# Altium schematic sheet 14.Power_DCIN.SchDoc
size A4; CheckedBy: YPC; DocumentNumber: 14; Revision: V1.00; SheetNumber: 14; SheetTotal: 18; SheetName: Power; SheetDescribe: SheetDescribe; Designer: JOW; DesignDate: 2025-04-25; CheckedData: 2025-04-25
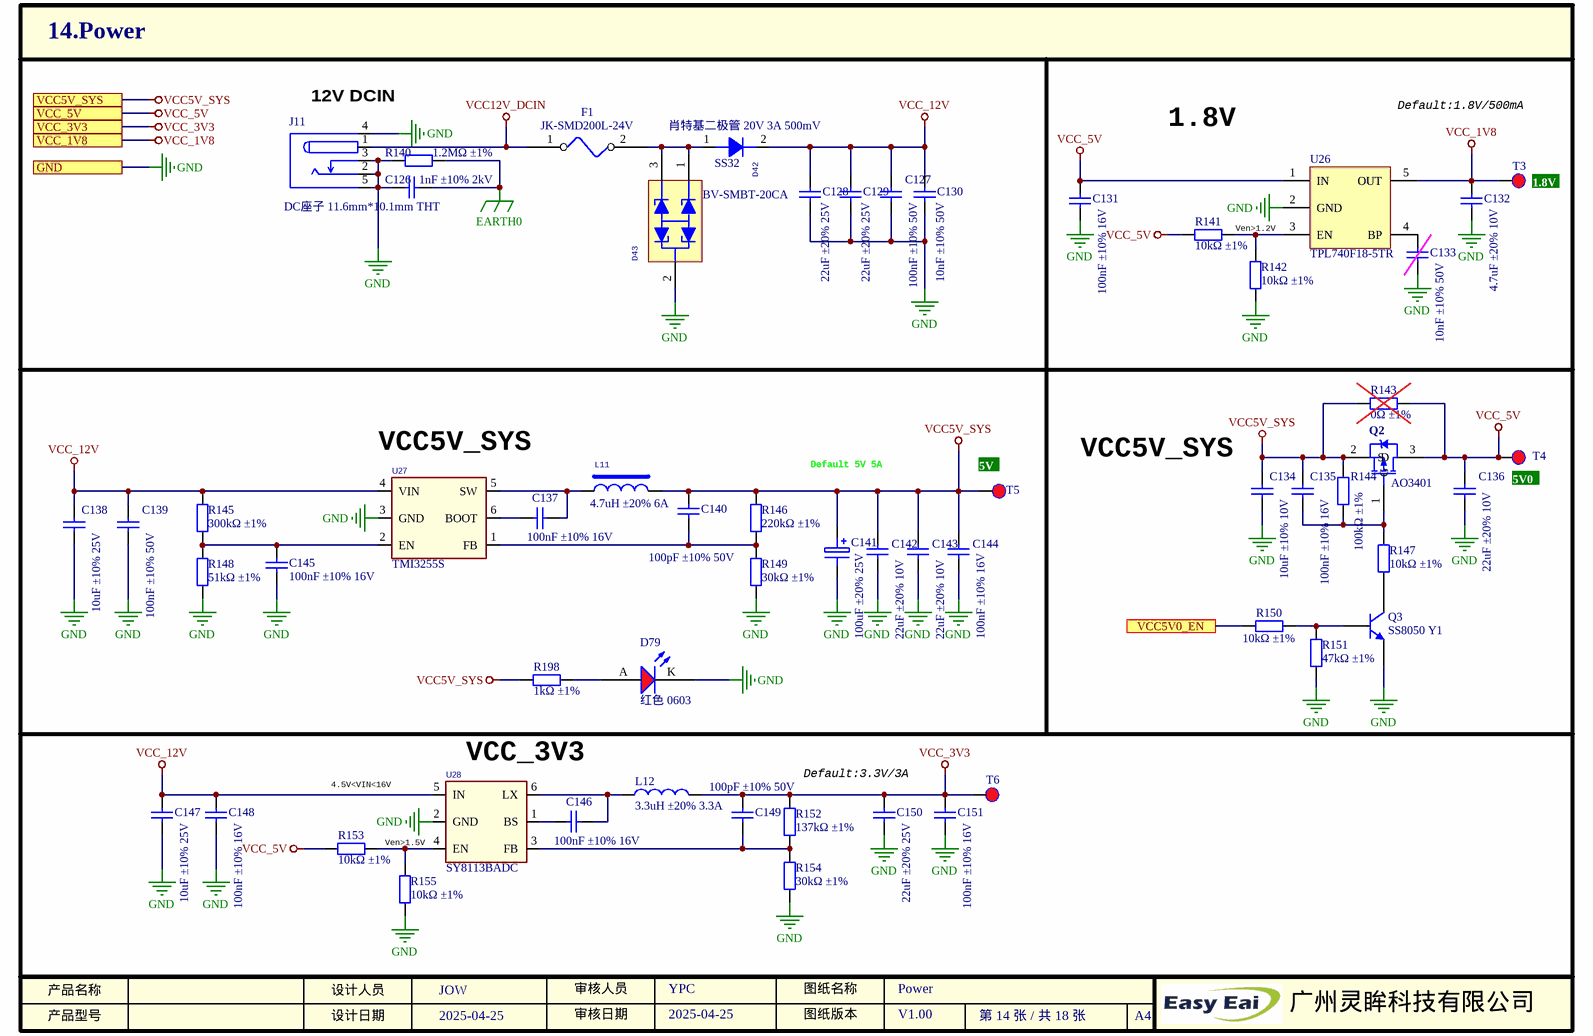
[diagram p0: 14.Power_DCIN.SchDoc]

## Parts
C126  描述: 1nF ±10% 2kV  [1206_C]  (hidden comment: CC1206KKX7RDBB102)
C127  描述: 100nF ±10% 50V  [0603_C]  (hidden comment: CC0603KRX7R9BB104)
C128  描述: 22uF ±20% 25V  [0805_C]  (hidden comment: GRM21BR61E226ME44L)
C129  描述: 22uF ±20% 25V  [0805_C]  (hidden comment: GRM21BR61E226ME44L)
C130  描述: 10nF ±10% 50V  [0402_C]  (hidden comment: CL05B103KB5NNNC)
C131  描述: 100nF ±10% 16V  [0402_C]  (hidden comment: CL05B104KO5NNNC)
C132  描述: 4.7uF ±20% 10V  [0402_C]  (hidden comment: CL05A475MP5NRNC)
C133  描述: 10nF ±10% 50V  [0402_C]  (hidden comment: NC/CL05B103KB5NNNC)  (no BOM)
C134  描述: 10uF ±10% 10V  [0603_C]  (hidden comment: CL10A106KP8NNNC)
C135  描述: 100nF ±10% 16V  [0402_C]  (hidden comment: CL05B104KO5NNNC)
C136  描述: 22uF ±20% 10V  [0603_C]  (hidden comment: CL10A226MP8NUNE)
C137  描述: 100nF ±10% 16V  [0402_C]  (hidden comment: CL05B104KO5NNNC)
C138  描述: 10uF ±10% 25V  [0805_C]  (hidden comment: GRM21BR61E106KA73L)
C139  描述: 100nF ±10% 50V  [0603_C]  (hidden comment: CC0603KRX7R9BB104)
C140  描述: 100pF ±10% 50V  [0402_C]  (hidden comment: CC0402KRX7R9BB101)
C141  描述: 100uF ±20% 25V  [SMD,D6.3xL7.7mm]  (hidden comment: RVT1E101M0607)
C142  描述: 22uF ±20% 10V  [0603_C]  (hidden comment: CL10A226MP8NUNE)
C143  描述: 22uF ±20% 10V  [0603_C]  (hidden comment: CL10A226MP8NUNE)
C144  描述: 100nF ±10% 16V  [0402_C]  (hidden comment: CL05B104KO5NNNC)
C145  描述: 100nF ±10% 16V  [0402_C]  (hidden comment: CL05B104KO5NNNC)
C146  描述: 100nF ±10% 16V  [0402_C]  (hidden comment: CL05B104KO5NNNC)
C147  描述: 10uF ±10% 25V  [0805_C]  (hidden comment: GRM21BR61E106KA73L)
C148  描述: 100nF ±10% 16V  [0402_C]  (hidden comment: CL05B104KO5NNNC)
C149  描述: 100pF ±10% 50V  [0402_C]  (hidden comment: CC0402KRX7R9BB101)
C150  描述: 22uF ±20% 25V  [0805_C]  (hidden comment: GRM21BR61E226ME44L)
C151  描述: 100nF ±10% 16V  [0402_C]  (hidden comment: CL05B104KO5NNNC)
D42  描述: 肖特基二极管 20V 3A 500mV  [DO_214AC]  (hidden comment: 肖特基二极管)
D43  BV-SMBT-20CA  [SMB-T_L5.4-W3.3-BI]
D79  红色 0603  [0603_LED_S1]
F1  JK-SMD200L-24V  [2920]
J11  DC-044A-20A  [DC-044A-20A]  (value not drawn)
L11  MWSA0603S-4R7MT  [IND-SMD_L7.0-W6.6]  (value not drawn)
L12  SMNR4030-3R3MT  [IND-4.0*4.0*3.0]  (value not drawn)
Q2  AO3401  [SOT-23]
Q3  SS8050 Y1  [SOT-23(SOT-23-3)]
R140  描述: 1.2MΩ ±1%  [1206_R]  (hidden comment: 1206W4F1204T5E)
R141  描述: 10kΩ ±1%  [0402_R]  (hidden comment: 0402WGF1002TCE)
R142  描述: 10kΩ ±1%  [0402_R]  (hidden comment: 0402WGF1002TCE)
R143  描述: 0Ω ±1%  [0805_R]  (hidden comment: NC/0805W8F0000T5E)  (no BOM)
R144  描述: 100kΩ ±1%  [0402_R]  (hidden comment: 0402WGF1003TCE)
R145  描述: 300kΩ ±1%  [0402_R]  (hidden comment: 0402WGF3003TCE)
R146  描述: 220kΩ ±1%  [0402_R]  (hidden comment: 0402WGF2203TCE)
R147  描述: 10kΩ ±1%  [0402_R]  (hidden comment: 0402WGF1002TCE)
R148  描述: 51kΩ ±1%  [0402_R]  (hidden comment: 0402WGF5102TCE)
R149  描述: 30kΩ ±1%  [0402_R]  (hidden comment: NQ02WGF3002TCE)
R150  描述: 10kΩ ±1%  [0402_R]  (hidden comment: 0402WGF1002TCE)
R151  描述: 47kΩ ±1%  [0402_R]  (hidden comment: 0402WGF4702TCE)
R152  描述: 137kΩ ±1%  [0402_R]  (hidden comment: 0402WGF1373TCE)
R153  描述: 10kΩ ±1%  [0402_R]  (hidden comment: 0402WGF1002TCE)
R154  描述: 30kΩ ±1%  [0402_R]  (hidden comment: NQ02WGF3002TCE)
R155  描述: 10kΩ ±1%  [0402_R]  (hidden comment: 0402WGF1002TCE)
R198  描述: 1kΩ ±1%  [0402_R]  (hidden comment: 0402WGF1001TCE)
T3  TEST-DOT  [PAD-25/40]  (value not drawn)  (no BOM)
T4  TEST-DOT  [PAD-25/40]  (value not drawn)
T5  TEST-DOT  [PAD-25/40]  (value not drawn)  (no BOM)
T6  TEST-DOT  [PAD-25/40]  (value not drawn)  (no BOM)
U26  TPL740F18-5TR  [SOT-23-5]
U27  TMI3255S  [SOT23-6]
U28  SY8113BADC  [sot23-6]

## Ports
GND, VCC5V0_EN, VCC5V_SYS, VCC_1V8, VCC_3V3, VCC_5V

## Nets
EARTH0: C126.2 R140.2
GND: C126.1 C127.1 C128.1 C129.1 C130.1 C131.1 C132.1 C133.1 C134.1 C136.1 C138.1 C139.1 C141.2 C142.1 C143.1 C144.1 C145.1 C147.1 C148.1 C150.1 C151.1 D43.2 D79.K J11.2 J11.3 J11.4 J11.5 Q3.2(E) R140.1 R142.1 R148.1 R149.1 R151.1 R154.1 R155.1 U26.2(GND) U27.3(GND) U28.2(GND) ; port GND
VCC5V_SYS: C134.2 C135.2 C140.2 C141.1 C142.2 C143.2 C144.2 L11.2 Q2.2(S) R143.1 R144.2 R146.2 R198.1 T5.1 ; port VCC5V_SYS
VCC12V_DCIN: F1.1 J11.1
VCC_1V8: C132.2 T3.1 U26.5(OUT) ; port VCC_1V8
VCC_3V3: C149.2 C150.2 C151.2 L12.2 R152.2 T6.1 ; port VCC_3V3
VCC_5V: C131.2 C136.2 Q2.3(D) R141.1 R143.2 R153.1 T4.1 U26.1(IN) ; port VCC_5V
VCC_12V: C127.2 C128.2 C129.2 C130.2 C138.2 C139.2 C147.2 C148.2 D42.2(K) R145.2 U27.4(VIN) U28.5(IN)
VCC5V0_EN: R150.1 ; port VCC5V0_EN
NetC133_2: C133.2 U26.4(BP)
NetC135_1: C135.1 Q2.1(G) R144.1 R147.2
NetC137_1: C137.1 U27.6(BOOT)
NetC137_2: C137.2 L11.1 U27.5(SW)
NetC140_1: C140.1 R146.1 R149.2 U27.1(FB)
NetC145_2: C145.2 R145.1 R148.2 U27.2(EN)
NetC146_1: C146.1 U28.1(BS)
NetC146_2: C146.2 L12.1 U28.6(LX)
NetC149_1: C149.1 R152.1 R154.2 U28.3(FB)
NetD42_1: D42.1(A) D43.1 D43.3 F1.2
NetD79_A: D79.A R198.2
NetQ3_1: Q3.1(B) R150.2 R151.2
NetQ3_3: Q3.3(C) R147.1
NetR141_2: R141.2 R142.2 U26.3(EN)
NetR153_2: R153.2 R155.2 U28.4(EN)

## Notes on the sheet
- (near J11) 12V DCIN
- Default:1.8V/500mA
- 1.8V
- (near R141) Ven>1.2V
- (near T3) 1.8V
- (near U27) VCC5V_SYS
- Default 5V 5A
- (near T5) 5V
- VCC5V_SYS
- (near T4) 5V0
- 4.5V<VIN<16V
- (near U28) VCC_3V3
- Default:3.3V/3A
- Ven>1.5V
- 产品名称
- 产品型号
- 设计人员
- 设计日期
- 审核人员
- 审核日期
- 图纸版本
- 图纸名称
- A4
- 广州灵眸科技有限公司

## Library data of the parts
C126 = 1206 1nF ±10% 2kV: SPZL000332; 名称: 贴片电容; 厂商: YAGEO(国巨); 封装: 1206; 工作温度: -55~125℃; 贴片和直插: SMD; 型号: CC1206KKX7RDBB102; SuppliersPartNumber: C23631; 商品编号: SPZL000332
C127 C139 = 0603 100nF ±10% 50V: SPZL000386; 名称: 贴片电容; 厂商: YAGEO(国巨); 封装: 0603; 工作温度: -55~125℃; 贴片和直插: SMD; 型号: CC0603KRX7R9BB104; SuppliersPartNumber: C14663; 商品编号: SPZL000386
C128 C129 C150 = 0805 22uF ±20% 25V: SPZL000267; 名称: 贴片电容; 厂商: muRata(村田); 封装: 0805; 工作温度: -55~85℃; 贴片和直插: SMD; 型号: GRM21BR61E226ME44L; SuppliersPartNumber: C86816; 商品编号: SPZL000267
C130 C133 = 0402 10nF ±10% 50V: SPZL000342; 名称: 贴片电容; 厂商: SAMSUNG(三星); 封装: 0402; 工作温度: -55~125℃; 贴片和直插: SMD; 型号: CL05B103KB5NNNC; SuppliersPartNumber: C15195; 商品编号: SPZL000342
C131 C135 C137 C144-C146 C148 C151 = 0402 100nF ±10% 16V: SPZL000259; 名称: 贴片电容; 厂商: SAMSUNG(三星); 封装: 0402; 工作温度: -55~125℃; 贴片和直插: SMD; 型号: CL05B104KO5NNNC; SuppliersPartNumber: C1525; 商品编号: SPZL000259
C132 = 0402 4.7uF ±20% 10V: SPZL000339; 名称: 贴片电容; 厂商: SAMSUNG(三星); 封装: 0402; 工作温度: -55~85℃; 贴片和直插: SMD; 型号: CL05A475MP5NRNC; SuppliersPartNumber: C23733; 商品编号: SPZL000339
C134 = 0603 10uF ±10% 10V: SPZL000260; 名称: 贴片电容; 厂商: SAMSUNG(三星); 封装: 0603; 工作温度: -55~85℃; 贴片和直插: SMD; 型号: CL10A106KP8NNNC; SuppliersPartNumber: C19702; 商品编号: SPZL000260
C136 C142 C143 = 0603 22uF ±20% 10V: SPZL000315; 名称: 贴片电容; 厂商: SAMSUNG(三星); 封装: 0603; 工作温度: -55~85℃; 贴片和直插: SMD; 型号: CL10A226MP8NUNE; SuppliersPartNumber: C86295; 商品编号: SPZL000315
C138 C147 = 0805 10uF ±10% 25V: SPZL000262; 名称: 贴片电容; 厂商: muRata(村田); 封装: 0805; 工作温度: -55~85℃; 贴片和直插: SMD; 型号: GRM21BR61E106KA73L; SuppliersPartNumber: C84416; 商品编号: SPZL000262
C140 C149 = 0402 100pF ±10% 50V: SPZL000312; 名称: 贴片电容; 厂商: YAGEO(国巨); 封装: 0402; 工作温度: -55~125℃; 贴片和直插: SMD; 型号: CC0402KRX7R9BB101; SuppliersPartNumber: C281751; 商品编号: SPZL000312
C141 = 电解电容 100uF ±20% 25V: SPZL000519; 名称: 电解电容; 厂商: ROQANG(容强); 贴片和直插: SMD; 工作温度: -45~105℃; SuppliersPartNumber: C72477; 封装: SMD,D6.3xL7.7mm; 型号: RVT1E101M0607; 商品编号: SPZL000519
D42 = SS32: SPZL000094; 名称: 二极管; 厂商: MDD; 贴片和直插: SMD; 封装: SMA(DO-214AC); 工作温度: -55~125℃; SuppliersPartNumber: C34897; 商品编号: SPZL000094; 型号: SS32
D43 = TVS BV-SMBT-20CA: SPZL000611; 名称: TVS; 封装: SMB-T; 贴片和直插: SMD; 厂商: Bencent(槟城); 描述: Cj=2500pF; 工作温度: -40~125℃; 商品编号: SPZL000611; 型号: BV-SMBT-20CA
D79 = 红色 0603: SPZL000214; 厂商: EVERLIGHT(台湾亿光); 封装: 0603; 贴片和直插: SMD; 型号: 19-217/R6C-AL1M2VY/3T; 名称: LED; 工作温度: -40~85℃; SuppliersPartNumber: C72044; 商品编号: SPZL000214; 描述: 红色 0603
F1 = 自恢复保险丝 JK-SMD200L-24V: SPZL000105; 厂商: JK(金科); 名称: 自恢复保险丝; 贴片和直插: SMD; 描述: 2A/24V; 工作温度: -40~85℃; 封装: 2920; SuppliersPartNumber: C692154; 商品编号: SPZL000105; 型号: JK-SMD200L-24V
J11 = DC座子 11.6mm*10.1mm THT: SPZL000133; 封装: THT; 厂商: 韩国韩荣; 名称: 电源插座; 工作温度: -20~70℃; 贴片和直插: THT; SuppliersPartNumber: C129006; 型号: DC-044A-20A; 商品编号: SPZL000133; 描述: DC座子 11.6mm*10.1mm THT
L11 = 4.7uH ±20% 6A: SPZL001133; 厂商: Sunlord(顺络); 贴片和直插: SMD; 名称: 电感; 封装: SMD,7x6.6mm; 工作温度: -40~125℃; SuppliersPartNumber: C408447; 型号: MWSA0603S-4R7MT; 商品编号: SPZL001133; 描述: 4.7uH ±20% 6A
L12 = 3.3uH ±20% 3.3A: SPZL000206; 名称: 电感; 封装: 4.0*4.0*3.0mm; 贴片和直插: SMD; 厂商: SXN(顺翔诺); 工作温度: -40~125℃; SuppliersPartNumber: C135269; 型号: SMNR4030-3R3MT; 商品编号: SPZL000206; 描述: 3.3uH ±20% 3.3A
Q2 = P沟道 AO3401: SPZL000800; 名称: MOS管; 厂商: TWGMC(台湾迪嘉); 贴片和直插: SMD; 描述: P沟道 30V 4.2A; 工作温度: -40~105℃; 封装: SOT-23; SuppliersPartNumber: C727156; 商品编号: SPZL000800; 型号: AO3401
Q3 = NPN SS8050 Y1: SPZL000089; 封装: SOT-23; 厂商: CJ（江苏长电/长晶）; 名称: 三极管; 贴片和直插: SMD; 描述: NPN 25V 1.5A; 工作温度: -55~150℃; SuppliersPartNumber: C2150; 商品编号: SPZL000089; 型号: SS8050 Y1
R140 = 1206 1.2MΩ ±1%: SPZL000388; 封装: 1206; 厂商: UNI-ROYAL(厚声); 名称: 电阻; 贴片和直插: SMD; 工作温度: -55~155℃; SuppliersPartNumber: C22107; 型号: 1206W4F1204T5E; 商品编号: SPZL000388
R141 R142 R147 R150 R153 R155 = 0402 10kΩ ±1%: SPZL000271; 封装: 0402; 厂商: UNI-ROYAL(厚声); 贴片和直插: SMD; 名称: 电阻; 工作温度: -55~155℃; SuppliersPartNumber: C25744; 型号: 0402WGF1002TCE; 商品编号: SPZL000271
R143 = 0805 0Ω ±1%: SPZL000350; 封装: 0805; 厂商: UNI-ROYAL(厚声); 名称: 电阻; 贴片和直插: SMD; 工作温度: -55~155℃; SuppliersPartNumber: C17477; 型号: 0805W8F0000T5E; 商品编号: SPZL000350
R144 = 0402 100kΩ ±1%: SPZL000282; 封装: 0402; 厂商: UNI-ROYAL(厚声); 贴片和直插: SMD; 名称: 电阻; 工作温度: -55~155℃; SuppliersPartNumber: C25741; 型号: 0402WGF1003TCE; 商品编号: SPZL000282
R145 = 0402 300kΩ ±1%: SPZL000393; 封装: 0402; 厂商: UNI-ROYAL(厚声); 贴片和直插: SMD; 名称: 电阻; 工作温度: -55~155℃; SuppliersPartNumber: C25774; 型号: 0402WGF3003TCE; 商品编号: SPZL000393
R146 = 0402 220kΩ ±1%: SPZL000877; 封装: 0402; 厂商: UNI-ROYAL(厚声); 贴片和直插: SMD; 名称: 电阻; 工作温度: -55~125℃; SuppliersPartNumber: C25767; 型号: 0402WGF2203TCE; 商品编号: SPZL000877
R148 = 0402 51kΩ ±1%: SPZL000788; 封装: 0402; 厂商: UNI-ROYAL(厚声); 贴片和直插: SMD; 名称: 电阻; 工作温度: -55~155℃; SuppliersPartNumber: C25794; 型号: 0402WGF5102TCE; 商品编号: SPZL000788
R149 R154 = 0402 30kΩ ±1%: SPZL000323; 封装: 0402; 厂商: UNI-ROYAL(厚声); 贴片和直插: SMD; 名称: 电阻; 工作温度: -55~155℃; SuppliersPartNumber: C965267; 型号: NQ02WGF3002TCE; 商品编号: SPZL000323
R151 = 0402 47kΩ ±1%: SPZL000348; 封装: 0402; 厂商: UNI-ROYAL(厚声); 贴片和直插: SMD; 名称: 电阻; 工作温度: -55~155℃; SuppliersPartNumber: C25792; 型号: 0402WGF4702TCE; 商品编号: SPZL000348
R152 = 0402 137kΩ ±1%: SPZL000322; 封装: 0402; 厂商: UNI-ROYAL(厚声); 贴片和直插: SMD; 名称: 电阻; 工作温度: -55~155℃; SuppliersPartNumber: C32298; 型号: 0402WGF1373TCE; 商品编号: SPZL000322
R198 = 0402 1kΩ ±1%: SPZL000275; 封装: 0402; 厂商: UNI-ROYAL(厚声); 贴片和直插: SMD; 名称: 电阻; 工作温度: -55~125℃; SuppliersPartNumber: C11702; 型号: 0402WGF1001TCE; 商品编号: SPZL000275
U26 = TPL740F18-5TR: SPZL000630; 名称: 电源IC; 厂商: 3PEAK; 贴片和直插: SMD; 描述: LDO; 工作温度: -40~85℃; 封装: SOT-23-5; SuppliersPartNumber: *; 商品编号: SPZL000630; 型号: TPL740F18-5TR
U27 = TMI3255S: SPZL001130; 厂商: Toll(拓尔微); 贴片和直插: SMD; 名称: 电源IC; 描述: DC-DC; 工作温度: -40℃~125℃; 封装: SOT23-6; 商品编号: SPZL001130; 型号: TMI3255S
U28 = SY8113BADC: SPZL000041; 厂商: silergy(矽力杰); 封装: TSOT-23-6; 贴片和直插: SMD; 名称: 电源IC; 描述: DC-DC; 工作温度: -40~85℃; SuppliersPartNumber: C78989; 商品编号: SPZL000041; 型号: SY8113BADC